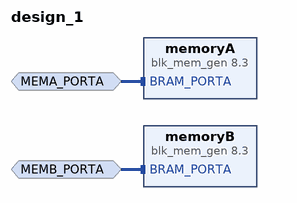
[diagram p0: block diagram of the top level]
# Vivado block design design_1, xc7z020clg484-1, Vivado 2016.4
create_bd_design design_1

create_bd_intf_port -mode Slave -vlnv xilinx.com:interface:bram_rtl:1.0 MEMB_PORTA
set_property -dict {CONFIG.MASTER_TYPE BRAM_CTRL} [get_bd_intf_ports MEMB_PORTA]
create_bd_intf_port -mode Slave -vlnv xilinx.com:interface:bram_rtl:1.0 MEMA_PORTA
set_property -dict {CONFIG.MASTER_TYPE BRAM_CTRL} [get_bd_intf_ports MEMA_PORTA]

create_bd_cell -type ip -vlnv xilinx.com:ip:blk_mem_gen:8.3 memoryB
create_bd_cell -type ip -vlnv xilinx.com:ip:blk_mem_gen:8.3 memoryA

# ---- connections ----

connect_bd_intf_net [get_bd_intf_ports MEMB_PORTA] [get_bd_intf_pins memoryB/BRAM_PORTA]
connect_bd_intf_net -intf_net BRAM_PORTA_1_1 [get_bd_intf_ports MEMA_PORTA] [get_bd_intf_pins memoryA/BRAM_PORTA]

validate_bd_design
save_bd_design
